# Altium project PCB_Project1.PrjPCB
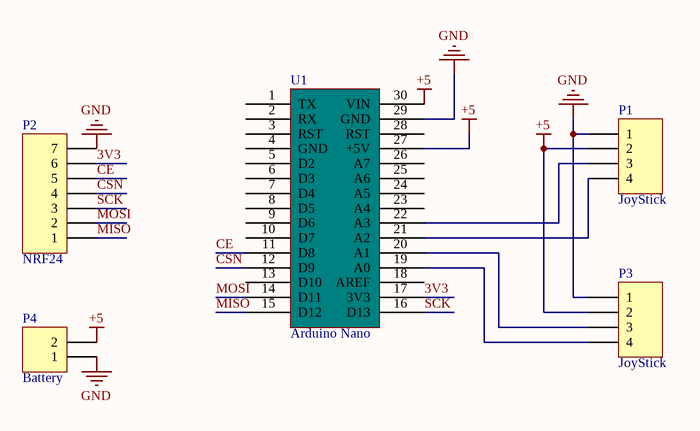
[diagram p0: Sheet1.SchDoc]
1 sheet, 5 parts. Net scope: global (net labels, ports and power ports of the same name join across sheets).
Board file: PCB1.PcbDoc

## Sheet Sheet1.SchDoc
size A

### Parts
P1  JoyStick  [HDR1X4]
P2  NRF24  [HDR1X7]
P3  JoyStick  [HDR1X4]
P4  Battery  [HDR1X2]
U1  Arduino Nano  [PCBComponent_1]

### Nets
+5: P1.2 P3.2 P4.2 U1.27(+5V) U1.30(VIN)
GND: P1.1 P2.7 P3.1 P4.1 U1.29(GND)
3V3: P2.6 U1.17(3V3)
CE: P2.5 U1.11(D8)
CSN: P2.4 U1.12(D9)
MISO: P2.1 U1.15(D12)
MOSI: P2.2 U1.14(D11)
SCK: P2.3 U1.16(D13)
NetP1_3: P1.3 U1.22(A3)
NetP1_4: P1.4 U1.21(A2)
NetP3_3: P3.3 U1.20(A1)
NetP3_4: P3.4 U1.19(A0)

Not connected (* = marked no-connect by the designer): U1 1(TX) 2(RX) 3(RST) 4(GND) 5(D2) 6(D3) 7(D4) 8(D5) 9(D6) 10(D7) 13(D10) 18(AREF) 23(A4) 24(A5) 25(A6) 26(A7) 28(RST)

### Library data of the parts
P1 P3 = Header 4: Header, 4-Pin; LatestRevisionDate: 17-Jul-2002; LatestRevisionNote: Re-released for DXP Platform.; Publisher: Altium Limited
P2 = Header 7: Header, 7-Pin; LatestRevisionDate: 17-Jul-2002; LatestRevisionNote: Re-released for DXP Platform.; Publisher: Altium Limited
P4 = Header 2: Header, 2-Pin; LatestRevisionDate: 17-Jul-2002; LatestRevisionNote: Re-released for DXP Platform.; Publisher: Altium Limited
U1 = Component_1